# Altium schematic sheet Puerto VGA.SchDoc
size B
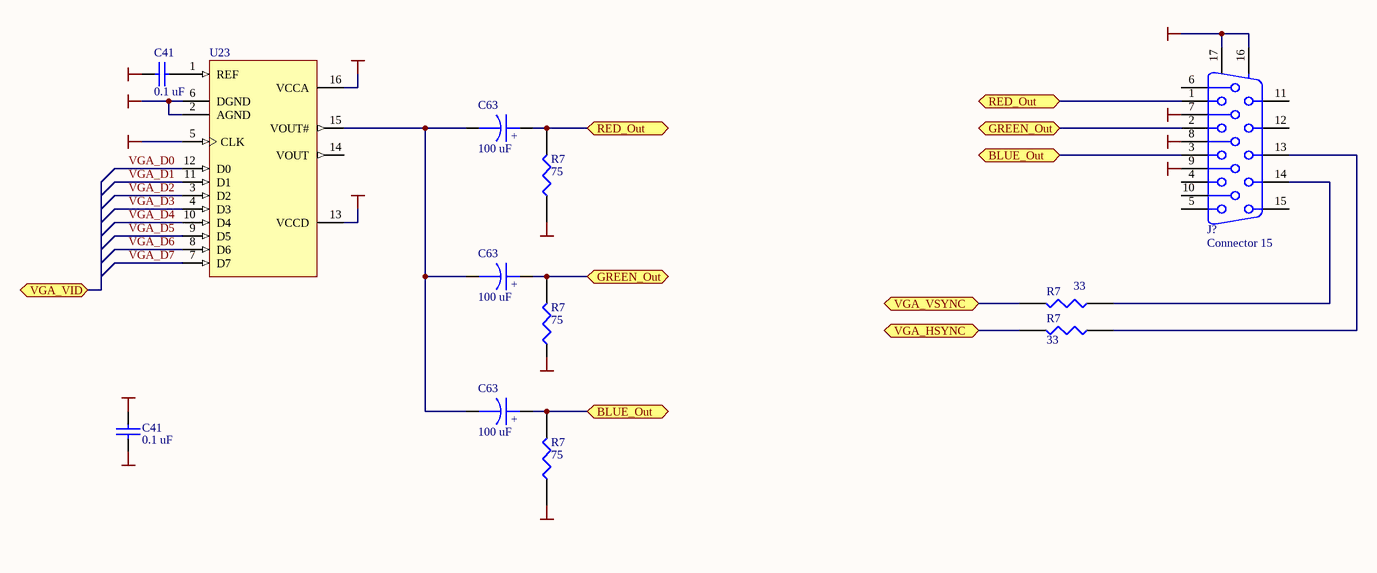
[diagram p0: Puerto VGA.SchDoc]

## Parts
(Parts that share a designator on the sheet are numbered #1, #2 ... from top to bottom, then left to right.)
C41#1  0.1 uF  [CAP 10]
C41#2  0.1 uF  [CAP 10]
C63#1  100 uF  [CAPACITOR GRANDE 2]
C63#2  100 uF  [CAPACITOR GRANDE 2]
C63#3  100 uF  [CAPACITOR GRANDE 2]
J?  Connector 15  [050DSUB0.762-4H15]
R7#1  75  [AXIAL-0.4]
R7#2  33  [AXIAL-0.4]
R7#3  75  [AXIAL-0.4]
R7#4  33  [AXIAL-0.4]
R7#5  75  [AXIAL-0.4]
U23  (no value)

## Ports
BLUE_Out, GREEN_Out, RED_Out, VGA_HSYNC, VGA_VID, VGA_VSYNC

## Nets
GND: C41#1.1 C41#2.1 J?.7 J?.8 J?.9 J?.16(MH1) J?.17(MH2) R7#1.1 R7#5.1 U23.2(AGND) U23.5(CLK) U23.6(DGND)
VCC_5V: C41#2.2 U23.13(VCCD) U23.16(VCCA)
BLUE_Out: C63#3.1 J?.3 R7#5.2 ; port BLUE_Out
GREEN_Out: C63#2.1 J?.2 R7#3.2 ; port GREEN_Out
RED_Out: C63#1.1 J?.1 R7#1.2 ; port RED_Out
VGA_D0: U23.12(D0)
VGA_D1: U23.11(D1)
VGA_D2: U23.3(D2)
VGA_D3: U23.4(D3)
VGA_D4: U23.10(D4)
VGA_D5: U23.9(D5)
VGA_D6: U23.8(D6)
VGA_D7: U23.7(D7)
VGA_HSYNC: R7#4.2 ; port VGA_HSYNC
VGA_VSYNC: R7#2.2 ; port VGA_VSYNC
NetC41#1_2: C41#1.2 U23.1(REF)
NetC63#1_2: C63#1.2 C63#2.2 C63#3.2 U23.15(VOUT#)
NetJ?_13: J?.13 R7#4.1
NetJ?_14: J?.14 R7#2.1

Not connected (* = marked no-connect by the designer): J? 4 5 6 10 11 12 15; R7#3 1; U23 14(VOUT)

## Notes on the sheet
- Labels drawn without touching a wire or pin: GND
- (in symbol CAPACITOR POL) +

## Library data of the parts
C41#1 C41#2 = CAP: Capacitor
C63#1-C63#3 = CAPACITOR POL: Capacitor
J? = Connector 15: Receptacle Assembly, 15-Pin Connector; Manufacturer: Generic Components; Positions: 15; Gender: Receptacle Header; Published: 15/06/2001; Publisher: Altium Hobart Technology Centre; Class: Connector; Orientation: Right Angle
R7#1-R7#5 = RES1
U23 = TDA8702